# Altium schematic sheet FEEL_2021_power_management.SchDoc
size A4; SheetNumber: 2; SheetTotal: 5
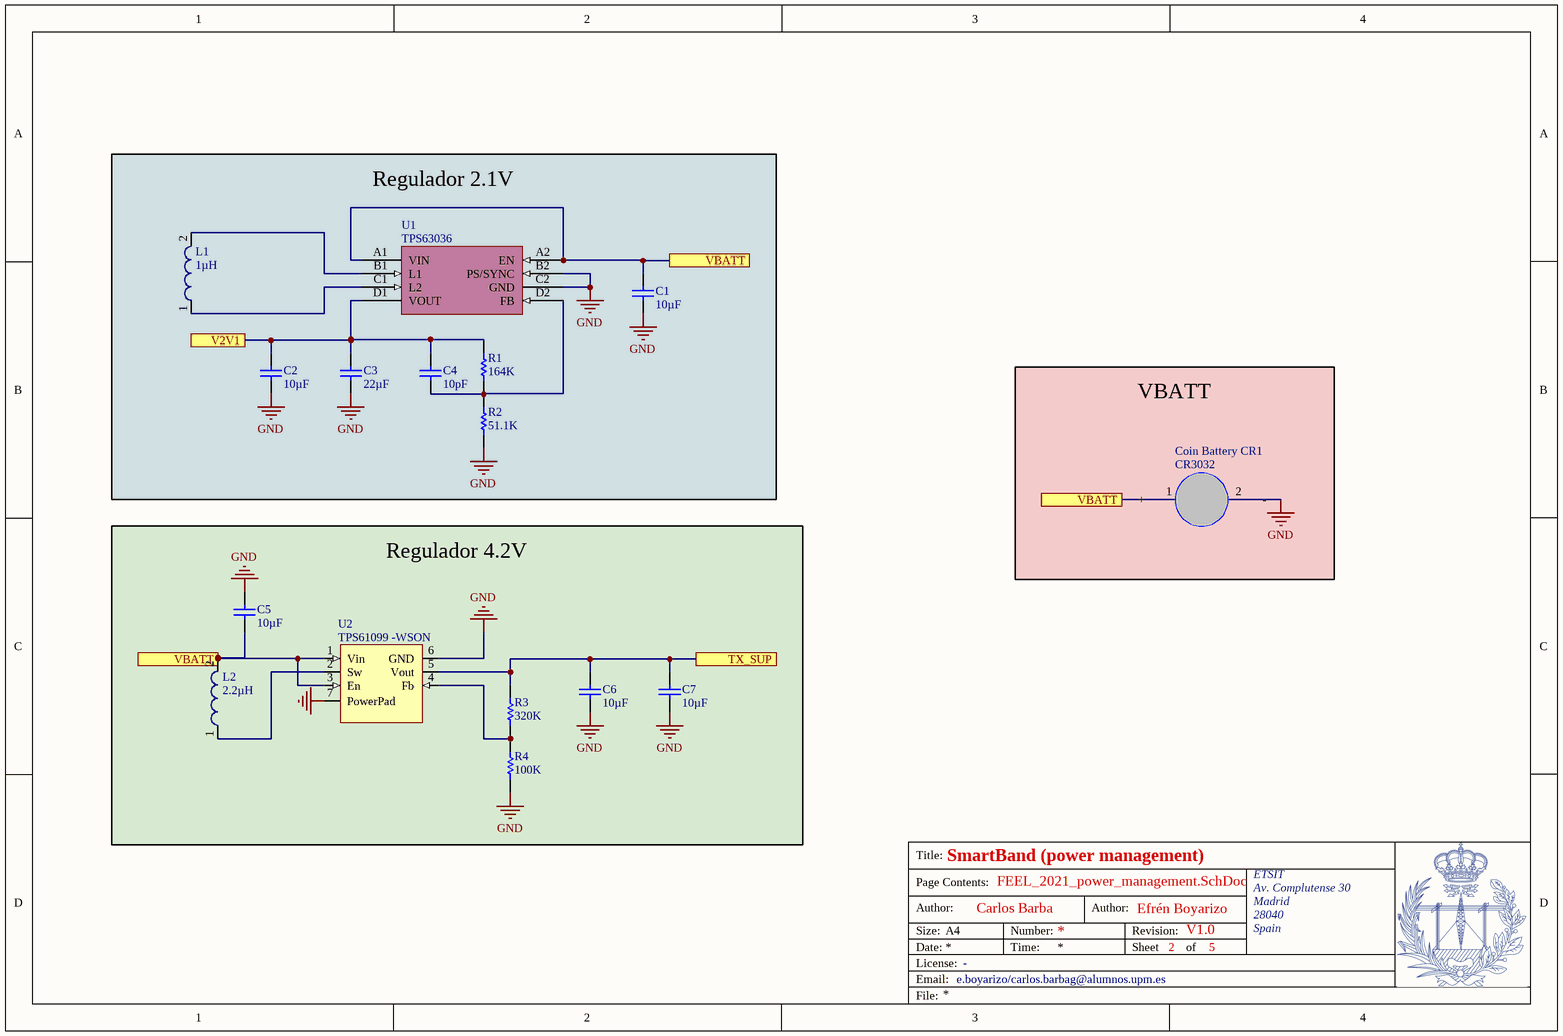
[diagram p0: FEEL_2021_power_management.SchDoc]

## Parts
C1  10µF  [CAPC1608X90X35ML10T15]
C2  10µF  [CAPC1608X90X35ML10T15]
C3  22µF  [CAPC1608X90X35ML10T15]
C4  10pF  [CAPC1608X90X35ML10T15]
C5  10µF  [CAPC1608X90X35ML10T15]
C6  10µF  [CAPC1608X90X35ML10T15]
C7  10µF  [CAPC1608X90X35ML10T15]
Coin_Battery_CR1  (no value)  [CR3032]
L1  1µH  [SMD 2510]
L2  2.2µH  [SMD 2510]
R1  164K  [RESC1609X50X30NL8T20]
R2  51.1K  [RESC1609X50X30NL8T20]
R3  320K  [RESC1609X50X30NL8T20]
R4  100K  [RESC1609X50X30NL8T20]
U1  (no value)  [tps63036]
U2  (no value)  [SOP6]

## Ports
TX_SUP, V2V1, VBATT

## Nets
GND: C1.1 C2.1 C3.1 C5.2 C6.1 C7.1 Coin_Battery_CR1.2(-) R2.2 R4.2 U1.B2(PS/SYNC) U1.C2(GND) U2.6(GND) U2.7(PowerPad)
TX_SUP: C6.2 C7.2 R3.1 U2.5(Vout) ; port TX_SUP
V2V1: C2.2 C3.2 C4.2 R1.2 U1.D1(VOUT) ; port V2V1
VBATT: C1.2 C5.1 Coin_Battery_CR1.1(+) L2.2 U1.A1(VIN) U1.A2(EN) U2.1(Vin) U2.3(En) ; port VBATT
NetC4_1: C4.1 R1.1 R2.1 U1.D2(FB)
NetL1_1: L1.1 U1.C1(L2)
NetL1_2: L1.2 U1.B1(L1)
NetL2_1: L2.1 U2.2(Sw)
NetR3_2: R3.2 R4.1 U2.4(Fb)

## Notes on the sheet
- Regulador 2.1V
- (near Coin_Battery_CR1) VBATT
- Regulador 4.2V
- Title:
- SmartBand (power management)
- Author:
- Page Contents:
- Carlos Barba
- Efrén Boyarizo
- V1.0
- ETSIT
- Av. Complutense 30
- Madrid
- 28040
- Size:
- Date:
- File:
- License:
- Email:
- A4
- e.boyarizo/carlos.barbag@alumnos.upm.es
- -
- Number:
- Time:
- Revision:
- Sheet
- of
- 5
- Spain
- (in symbol TSP61099-WSON) TPS61099 -WSON

## Library data of the parts
C1-C7 = CMP-2000-04945-1: Manufacturer: Murata; Capacitance: 22pF; Tolerance (%): ±5%; Rated Voltage: 50V; Dielectric: C0G; Manufacturer URL: http://www.murata.com/; Datasheet Version: Jul-06; Package Reference: 603; Case Size/Dimension: 0603; Package Description: 2-Pin Surface Mount Device, Body 1.6 x 0.8 mm; Datasheet URL: https://datasheet.ciiva.com/11786/0900766b807a1cab-11786398.pdf
Coin_Battery_CR1 = CR3032
L1 L2 = CMP-1411-00017-1: Power Multilayer Inductor WE-MAPI, L=10.0µH; PartNumber: 74438323100; Manufacturer: Wuerth Elektronik; Inductance: 10.0ÂµH; ComponentLink1URL: http://www.we-online.com; ComponentLink2Description: Datasheet; ComponentLink1Description: Manufacturer URL; PackageReference: SMD 2510; ComponentLink2URL: http://katalog.we-online.de/kataloge/eisos/media/pdf/74438323100.pdf
R1-R4 = CMP-2000-03816-5: Chip Resistor, 0 Ohm, Jumper, 100 mW, -55 to 155 degC, 0603 (1608 Metric), RoHS, Tape and Reel; Manufacturer: Vishay Semiconductor; Voltage Rating: 75 V; Package Quantity: 5000; DatasheetVersion: 06/2012; Min Operating Temperature: -55 degC; ComponentLink1URL: http://www.vishay.com/; Mounting Technology: Surface Mount; Height: 0.45 mm; ComponentLink1Description: Manufacturer URL; REACH SVHC: Unknown; PackageReference: 0603; Packaging: Tape and Reel; Max Operating Temperature: 155 degC; Mount: Surface Mount; ComponentLink2Description: Datasheet; PackageDescription: 2-Pin Surface Mount Device, Body 1.575 x 0.85 mm; Length: 1.55 mm; ComponentLink2URL: http://www.vishay.com/docs/20035/dcrcwe3.pdf; Pins: 2; RoHSCompliant: true
U1 = TPS63036: Non-inverting buck-boost / converter able to provide a regulated output voltage / from an input supply that can be higher or lower than / the output voltage
U2 = TSP61099-WSON